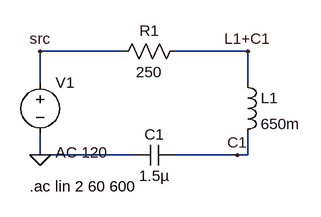
[diagram p0: schematic LCR CIRCUIT.asc]
LCR CIRCUIT.asc, the LTspice schematic file:
Version 4.1
SHEET 1 880 680
WIRE 192 80 64 80
WIRE 384 80 272 80
WIRE 64 128 64 80
WIRE 384 128 384 80
WIRE 64 240 64 208
WIRE 208 240 64 240
WIRE 368 240 272 240
WIRE 384 240 384 208
WIRE 384 240 368 240
FLAG 64 240 0
FLAG 64 80 src
FLAG 384 80 L1+C1
FLAG 368 240 C1
SYMBOL voltage 64 112 R0
WINDOW 123 24 124 Left 2
WINDOW 39 0 0 Left 0
SYMATTR InstName V1
SYMATTR Value ""
SYMATTR Value2 AC 120
SYMBOL res 288 64 R90
WINDOW 0 0 56 VBottom 2
WINDOW 3 32 56 VTop 2
SYMATTR InstName R1
SYMATTR Value 250
SYMBOL ind 368 112 R0
SYMATTR InstName L1
SYMATTR Value 650m
SYMBOL cap 272 224 R90
WINDOW 0 0 32 VBottom 2
WINDOW 3 32 32 VTop 2
SYMATTR InstName C1
SYMATTR Value 1.5µ
TEXT 48 288 Left 2 !.ac lin 2 60 600

The netlist it stands for:
* LCR CIRCUIT.asc
V1 src 0 AC 120
R1 L1+C1 src 250
L1 L1+C1 C1 650m
C1 C1 0 1.5µ
.ac lin 2 60 600
.backanno
.end